# EAGLE design clock (EAGLE 9.4.2)
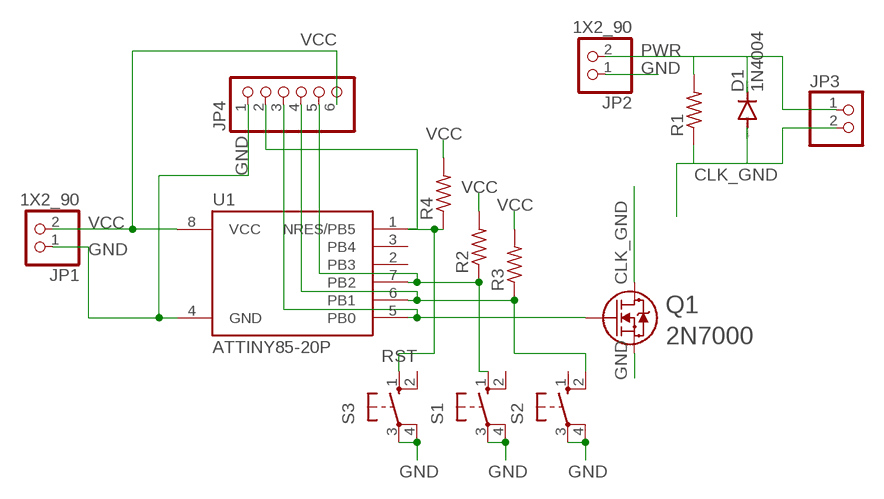
[diagram p0: schematic, sheet 1]

## Parts
D1  1N4004  [DO41-10]
JP1  1X2_90  [1X02/90]
JP2  1X2_90  [1X02/90]
JP3  PINHD-1X2  [1X02]
JP4  PINHD-1X6  [1X06]
Q1  2N7000  [TO-92]
R1  R-US_0204/7  [0204/7]
R2  R-US_0204/7  [0204/7]
R3  R-US_0204/7  [0204/7]
R4  R-US_0204/7  [0204/7]
S1  10-XX  [B3F-10XX]
S2  10-XX  [B3F-10XX]
S3  10-XX  [B3F-10XX]
U1  ATTINY85-20P  [PDIP08_300MIL]

## Nets
CLK_GND: D1.A JP3.2 Q1.3 R1.1
GND: JP1.1 JP2.1 JP4.1 Q1.1 S1.3(P) S1.4(P1) S2.3(P) S2.4(P1) S3.3(P) S3.4(P1) U1.4(GND)
MISO: JP4.4 R3.1 S2.2(S1) U1.6(PB1)
MOSI: JP4.3 Q1.2 U1.5(PB0)
PWR: D1.C JP2.2 JP3.1 R1.2
RST: JP4.2 R4.1 S3.1(S) U1.1(NRES/PB5)
SCK: JP4.5 R2.1 S1.1(S) U1.7(PB2)
VCC: JP1.2 JP4.6 R2.2 R3.2 R4.2 U1.8(VCC)
Unconnected: S1.2(S1) S2.1(S) S3.2(S1) U1.2(PB3) U1.3(PB4)

## Library data of the parts
D1 = diode:1N4004: DIODE general purpose rectifier, 1 A
JP1 JP2 = pins:1X2_90
JP3 = pinhead:PINHD-1X2: PIN HEADER
JP4 = pinhead:PINHD-1X6: PIN HEADER
Q1 = 2n7000:2N7000; MANUFACTURER_PART_NUMBER: 2N7000; VENDOR: STMicroelectronics
R1-R4 = resistor:R-US_: RESISTOR, American symbol
S1-S3 = switch-omron:10-XX: OMRON SWITCH; MPN: B3F-1000; OC_FARNELL: 176432; OC_NEWARK: 36M3542
U1 = _hhn_attiny25_45_85:ATTINY85*: ATMEL ATtiny 85 Packages: P = PDIP 08 30mil S = SOIC 08 EIAJ 208mil Technologies Note: for complete ordering code (temp. range, finish, tape&reel etc.) see www.atmel.com • Supply Voltage: V = (1.8…5.5)V | [blank] = (2.7…5.5)V • Speed: 10 = 10 MHz | 20 = 20 MHz Author: Dipl.-Ing. FH Rainer Bayer HHN Hochschule Heilbronn (Heilbronn University), rainer.bayer@hs-heilbronn.de Ingenieurbüro ing-rb, mail@ing-rb.de

## Board
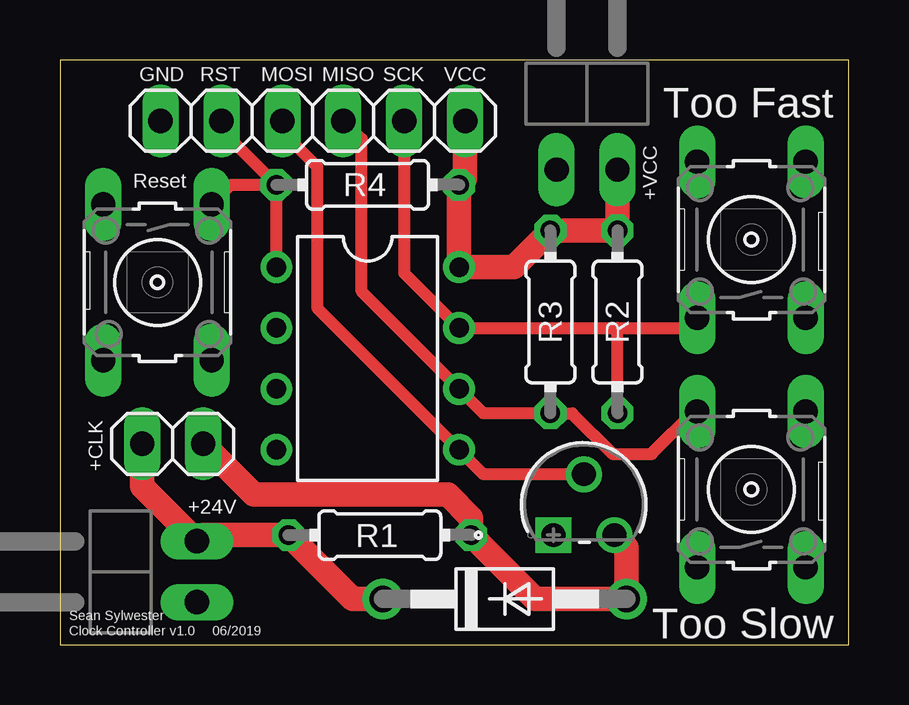
[diagram p1: board, top side]
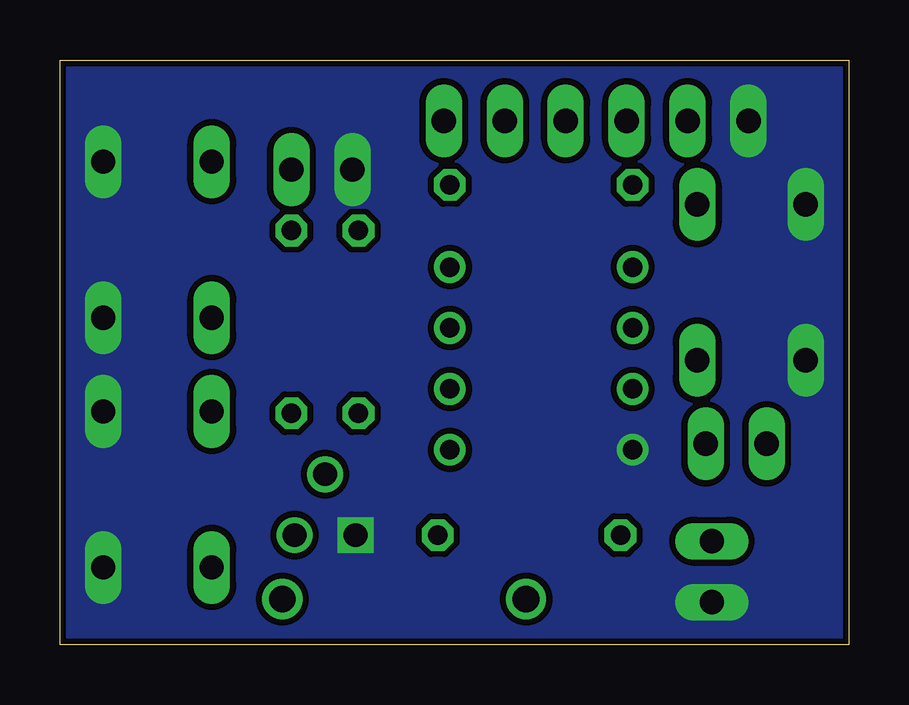
[diagram p2: board, bottom side, seen from below]

Size 32.89 x 24.38 mm. Coordinates in mm from the lower left corner, seen from the top.
Outline: 0,0 32.89,0 32.89,24.38 0,24.38 0,0
Copper layers (1*16): Top 0.035mm / dielectric 1.5mm / Bottom 0.035mm
Design rules "default *": minimum track width 6mil, minimum drill 0.35mm, track to track 6mil, track to pad 6mil, pad to pad 6mil, via to via 6mil, smd to smd 6mil, copper to edge 8mil, drill to drill 6mil, minimum pad ring 10mil, minimum via ring 8mil, stop-mask expansion 4mil, vias tented up to drill 0mil, thermal gap 10mil

### Footprints (pad centres in the part's own frame; a part is rotated, then mirrored left to right if it is on the bottom)
DO41-10 = drill 1.118: A 5.08,0; C -5.08,0
1X02/90 = drill 1.016 long: 1 -1.27,-3.81; 2 1.27,-3.81
1X02 = drill 1.016 long: 1 -1.27,0; 2 1.27,0
1X06 = drill 1.016 long: 1 -6.35,0; 2 -3.81,0; 3 -1.27,0; 4 1.27,0; 5 3.81,0; 6 6.35,0
TO-92 = drill 0.991 pad 1.499 square: 1 -2.54,-2.54 | drill 0.991 pad 1.499: 2 -1.27,0; 3 0,-2.54
0204/7 = drill 0.813 octagon: 1 -3.81,0; 2 3.81,0
B3F-10XX = drill 1.016 long: 1 -3.251,2.261; 2 3.251,2.261; 3 -3.251,-2.261; 4 3.251,-2.261
PDIP08_300MIL = drill 0.813: 1 -3.81,-3.81; 2 -1.27,-3.81; 3 1.27,-3.81; 4 3.81,-3.81; 5 3.81,3.81; 6 1.27,3.81; 7 -1.27,3.81; 8 -3.81,3.81

### Placement (x,y rotation side)
D1  18.54,1.91 0 top
JP1  21.97,23.62 0 top
JP2  1.91,3.05 90 top
JP3  4.7,8.38 0 top
JP4  10.54,21.84 0 top
Q1  23.11,7.11 0 top
R1  13.34,4.57 180 top
R2  23.24,13.46 90 top
R3  20.45,13.46 90 top
R4  12.83,19.18 0 top
S1  28.83,16.89 90 top
S2  28.83,6.48 90 top
S3  4.06,15.11 270 top
U1  12.83,11.94 270 top

### Tracks (layer width: path | path; a pad name or v marks a point on that pad's centre or on a via)
CLK_GND
  Top 1.016: Q1.3 23.62,4.06 D1.A 19.81,1.91 R1.1 17.14,5.3 16.17,6.27 8.08,6.27 JP3.2
GND
  pour Bottom (isolate 0.254, no thermals): 0,24.38 32.89,24.38 32.89,0 0,0
MISO
  Top 0.508: JP4.4 12.57,21.08 12.57,14.73 U1.6 17.65,9.65 R3.1 21.35,9.65 23.05,7.95 24.66,7.95 26.44,9.73 S2.2
MOSI
  Top 0.508: Q1.2 17.65,7.11 U1.5 10.72,14.05 10.72,19.93 9.27,21.38 JP4.3
PWR
  Top 1.016: D1.C 12.19,1.91 R1.2 5.97,4.57 JP2.2 3.43,6.6 JP3.1
RST
  Top 0.508: JP4.2 6.73,21.46 R4.1 | R4.1 U1.1 | S3.1 7.14,19.18 R4.1
SCK
  Top 0.508: JP4.5 14.35,15.49 U1.7 23.24,13.21 | S1.1 26.14,13.21 23.24,13.21 | R2.1 23.24,13.21
VCC
  Top 1.016: JP4.6 16.89,19.43 R4.2 U1.8 18.92,15.75 R3.2 R2.2 JP1.2

### Text on the board
tPlace: GND | RST | MOSI | MISO | SCK | VCC | Too Fast | Reset | +VCC | +CLK | +24V | Too Slow | Sean Sylwester | Clock Controller v1.0 | 06/2019